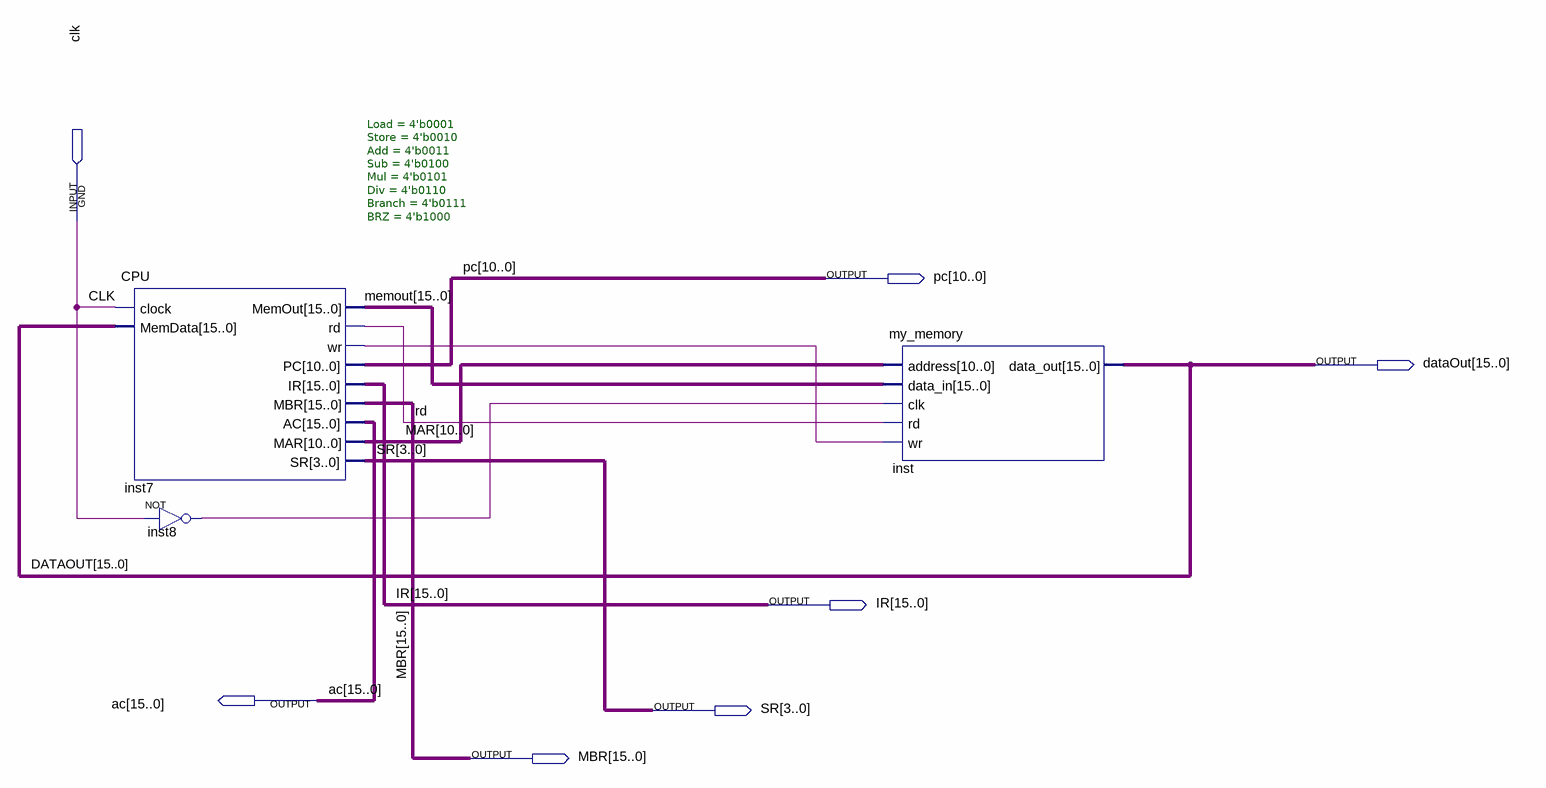
[diagram p0: schematic sheet]
// Quartus schematic simplecomp.bdf as structural Verilog: 3 symbols, 7 pins
module simplecomp (
  input  clk,
  output [10:0] pc,
  output [15:0] dataOut,
  output [15:0] IR,
  output [15:0] ac,
  output [3:0] SR,
  output [15:0] MBR
);

  wire inst7_wr, inst8_out, rd;
  wire [10:0] MAR;
  wire [15:0] memout;

  CPU #(.Load(4'b0001), .Store(4'b0010), .Add(4'b0011), .Sub(4'b0100), .Mul(4'b0101), .Div(4'b0110), .Branch(4'b0111), .BRZ(4'b1000)) inst7 (
    .clock(clk), .MemData(dataOut), .MemOut(memout), .rd(rd), .wr(inst7_wr), .PC(pc), .IR(IR), .MBR(MBR),
    .AC(ac), .MAR(MAR), .SR(SR));
  not inst8 (inst8_out, clk);
  my_memory inst (.address(MAR), .data_in(memout), .clk(inst8_out), .rd(rd), .wr(inst7_wr), .data_out(dataOut));
endmodule
